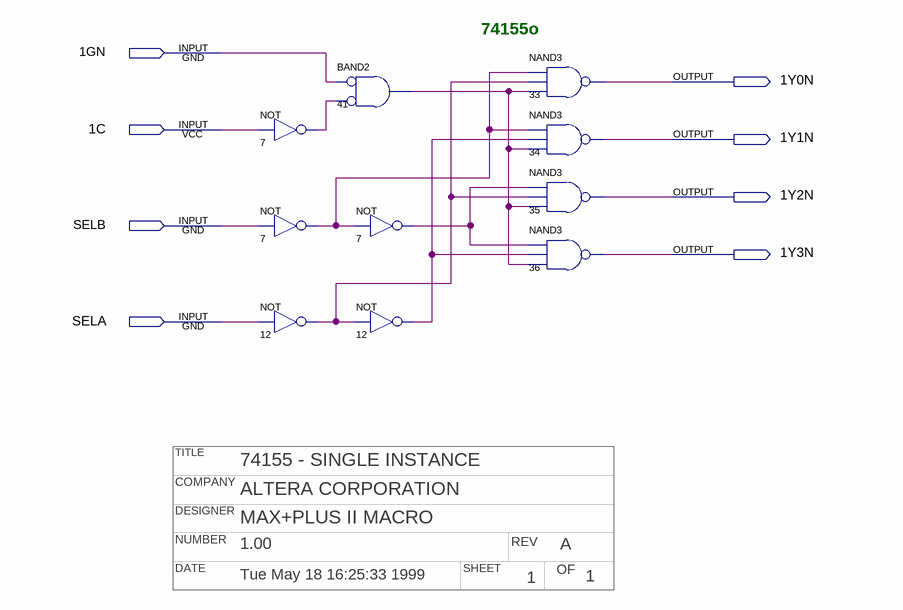
[diagram p0: schematic sheet]
// Quartus schematic 74155o.bdf as structural Verilog: 10 symbols, 8 pins
// Title block: TITLE: 74155 - SINGLE INSTANCE; COMPANY: ALTERA CORPORATION; DESIGNER: MAX+PLUS II MACRO; NUMBER: 1.00; REV: A; DATE: Tue May 18 16:25:33 1999; SHEET: 1; OF: 1
module \74155o  (
  input  \1GN ,
  input  \1C ,
  input  SELB,
  input  SELA,
  output \1Y0N ,
  output \1Y1N ,
  output \1Y2N ,
  output \1Y3N 
);

  wire n7_out, n7_out_2, n7_out_3, n12_out, n12_out_2, n41_out;

  not u_7 (n7_out, \1C );
  not u_7_dup2 (n7_out_3, SELB);
  not u_12 (n12_out_2, SELA);
  and u_41 (n41_out, ~\1GN , ~n7_out);  // BAND2
  not u_7_dup3 (n7_out_2, n7_out_3);
  not u_12_dup2 (n12_out, n12_out_2);
  nand u_33 (\1Y0N , n7_out_3, n12_out_2, n41_out);
  nand u_34 (\1Y1N , n7_out_3, n12_out, n41_out);
  nand u_35 (\1Y2N , n7_out_2, n12_out_2, n41_out);
  nand u_36 (\1Y3N , n7_out_2, n12_out, n41_out);

  // Notes on the sheet:
  //   74155o
endmodule
